# EAGLE design Group_07 (EAGLE 9.6.2)
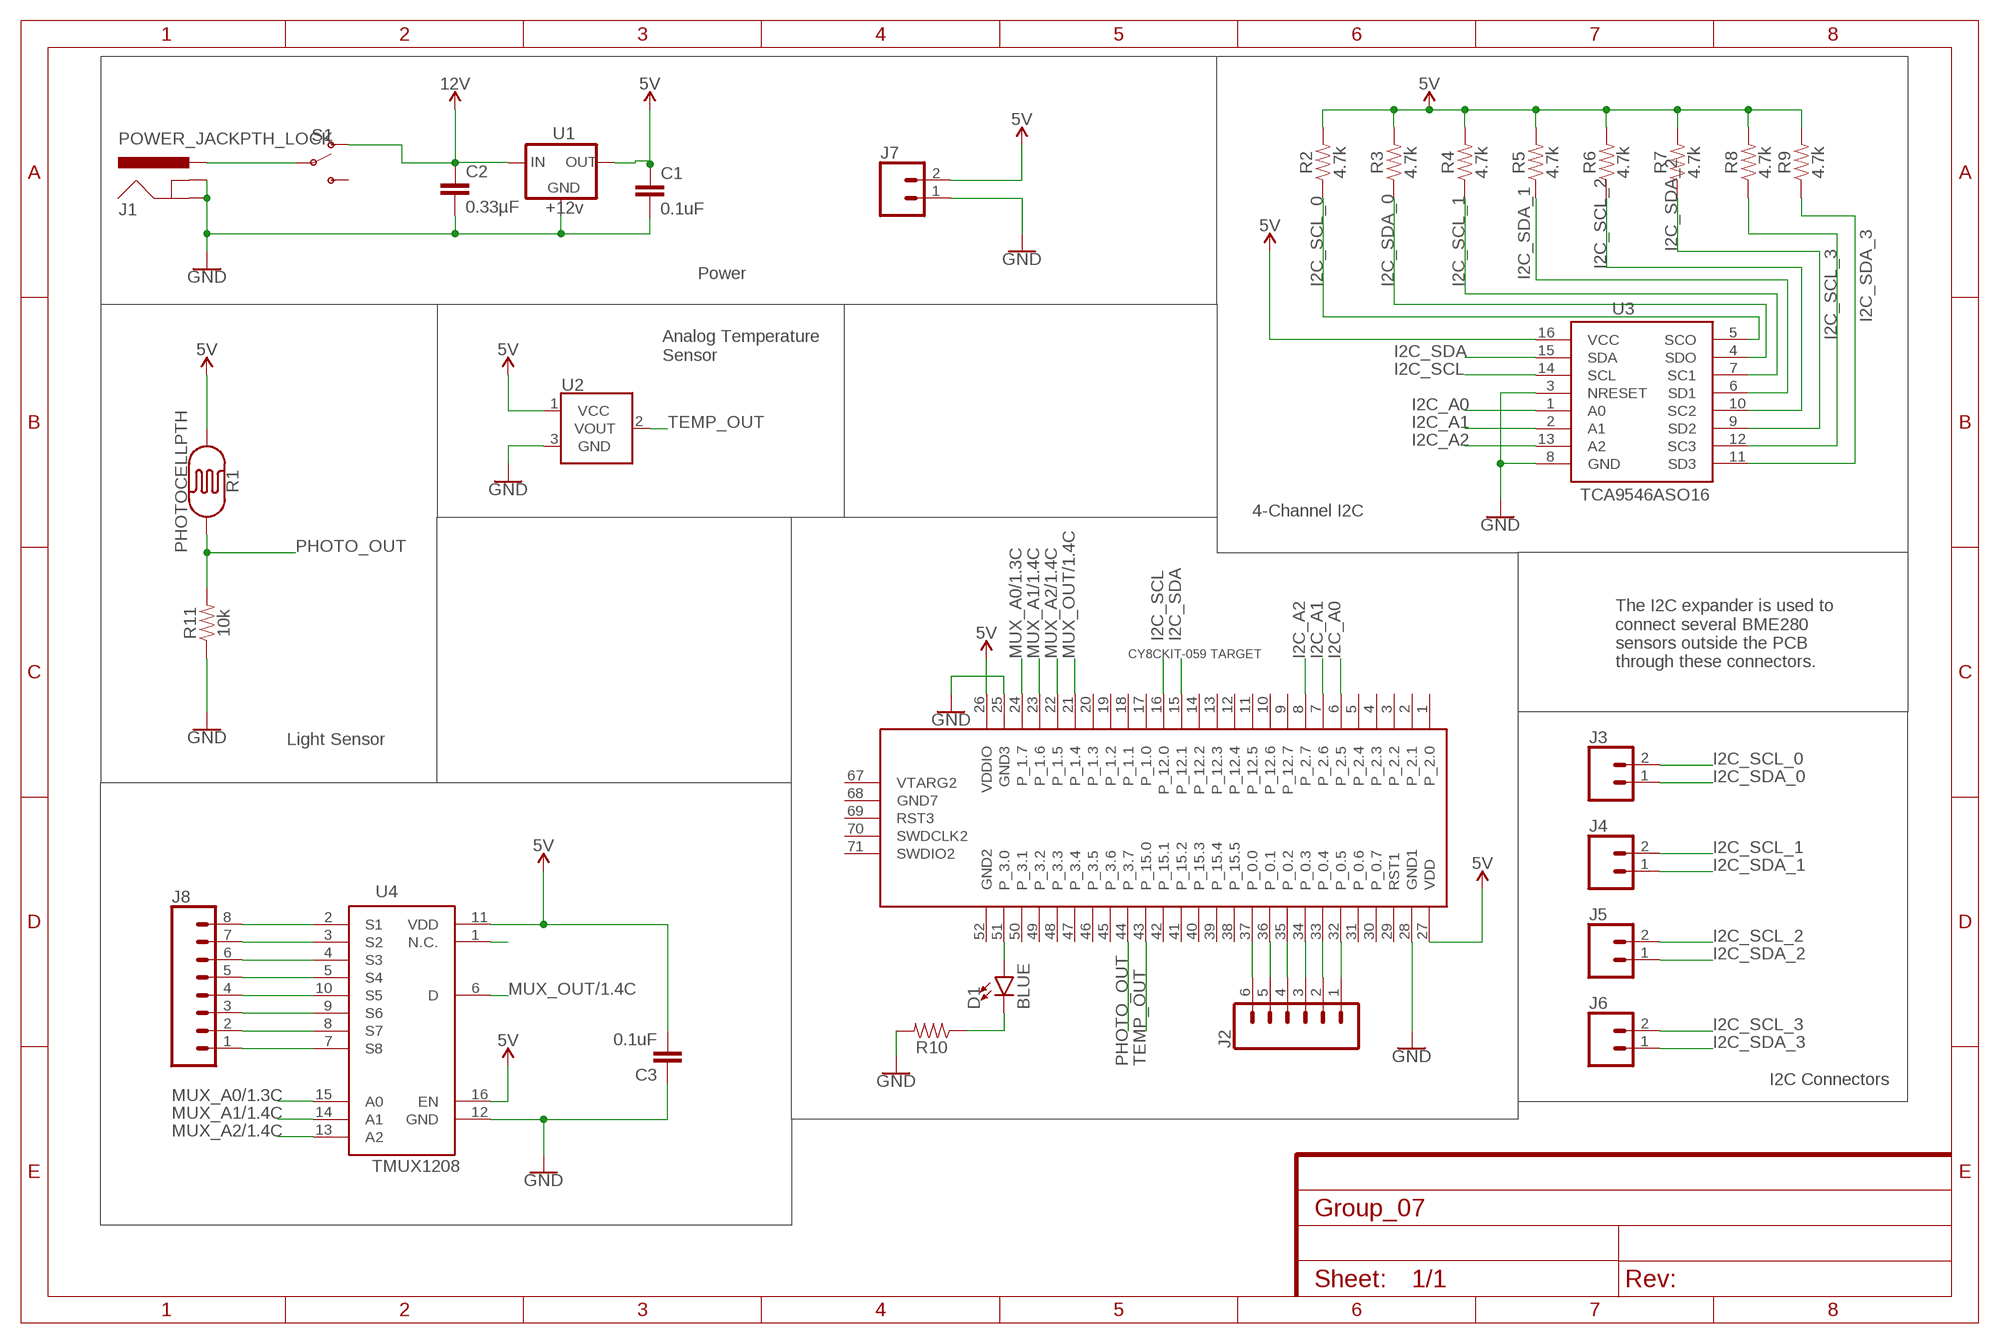
[diagram p0: schematic, sheet 1]

## Parts
C1  0.1uF  0.1UF-KIT-EZ-50V-20%  [CAP-PTH-SMALL-KIT]
C2  0.33µF  0.33UF/330NF-0805-50V-10%  [0805]
C3  0.1uF  0.1UF-KIT-EZ-50V-20%  [CAP-PTH-SMALL-KIT]
D1  BLUE  LED-BLUE1206  [LED-1206]
J1  POWER_JACKPTH_LOCK  [POWER_JACK_PTH_LOCK]
J2  CONN_06LOCK  [1X06_LOCK]
J3  CONN_02  [1X02]
J4  CONN_02  [1X02]
J5  CONN_02  [1X02]
J6  CONN_02  [1X02]
J7  CONN_02  [1X02]
J8  CONN_08LOCK  [1X08_LOCK]
R1  PHOTOCELLPTH  [PHOTOCELL]
R2  4.7k  4.7KOHM-0603-1/10W-1%  [0603]
R3  4.7k  4.7KOHM-0603-1/10W-1%  [0603]
R4  4.7k  4.7KOHM-0603-1/10W-1%  [0603]
R5  4.7k  4.7KOHM-0603-1/10W-1%  [0603]
R6  4.7k  4.7KOHM-0603-1/10W-1%  [0603]
R7  4.7k  4.7KOHM-0603-1/10W-1%  [0603]
R8  4.7k  4.7KOHM-0603-1/10W-1%  [0603]
R9  4.7k  4.7KOHM-0603-1/10W-1%  [0603]
R10  RESISTORAXIAL-0.3  [AXIAL-0.3]
R11  10k  10KOHM-0603-1/10W-1%  [0603]
S1  SWITCH-SPDT-PTH-11.6X4.0MM  [SWITCH_SPDT_PTH_11.6X4.0MM]
U1  +12v  V_REG_78XX7812  [TO-252]
U2  TMP36GT9  [TO-92]
U3  TCA9546ASO16  [TSSOP16]
U4  TMUX1208  [QFN16]
U$1  CY8CKIT-059_TARGET  [CY8CKIT-059_TARGET]

## Nets
5V: C1.1 C3.2 J7.2 R1.1 R2.2 R3.2 R4.2 R5.2 R6.2 R7.2 R8.2 R9.2 U1.2(OUT) U2.1(VCC) U3.16(VCC) U4.11(VDD) U$1.27(VDD)
12V: C2.1 S1.1(O) U1.1(IN)
GND: C1.2 C2.2 C3.1 J1.GND J1.GNDBREAK J7.1 R10.P$2 R11.1 U1.3(GND) U2.3(GND) U3.3(NRESET) U3.8(GND) U4.12(GND) U$1.25(GND3)
I2C_A0: U3.1(A0) U$1.6(P_2.5)
I2C_A1: U3.2(A1) U$1.7(P_2.6)
I2C_A2: U3.13(A2) U$1.8(P_2.7)
I2C_SCL: U3.14(SCL) U$1.16(P_12.0)
I2C_SCL_0: J3.2 R2.1 U3.5(SCO)
I2C_SCL_1: J4.2 R4.1 U3.7(SC1)
I2C_SCL_2: J5.2 R6.1 U3.10(SC2)
I2C_SCL_3: J6.2 R8.1 U3.12(SC3)
I2C_SDA: U3.15(SDA) U$1.15(P_12.1)
I2C_SDA_0: J3.1 R3.1 U3.4(SDO)
I2C_SDA_1: J4.1 R5.1 U3.6(SD1)
I2C_SDA_2: J5.1 R7.1 U3.9(SD2)
I2C_SDA_3: J6.1 R9.1 U3.11(SD3)
MUX_A0/1.3C: U4.15(A0) U$1.24(P_1.7)
MUX_A1/1.4C: U4.14(A1) U$1.23(P_1.6)
MUX_A2/1.4C: U4.13(A2) U$1.22(P_1.5)
MUX_OUT/1.4C: U4.6(D) U$1.21(P_1.4)
N$1: J1.PWR S1.2(P)
N$2: J8.8 U4.2(S1)
N$3: J2.6 U$1.37(P_0.0)
N$4: J2.5 U$1.36(P_0.1)
N$5: J2.4 U$1.35(P_0.2)
N$6: J2.3 U$1.34(P_0.3)
N$7: J2.2 U$1.33(P_0.4)
N$8: J2.1 U$1.32(P_0.5)
N$9: D1.A U$1.51(P_3.0)
N$10: D1.C R10.P$1
N$11: J8.7 U4.3(S2)
N$12: J8.6 U4.4(S3)
N$13: J8.5 U4.5(S4)
N$14: J8.4 U4.10(S5)
N$15: J8.3 U4.9(S6)
N$16: J8.2 U4.8(S7)
N$17: J8.1 U4.7(S8)
N$18: U$1.26(VDDIO) ; supply symbol labelled 5V
N$19: U4.1(N.C.)
N$20: U$1.28(GND1) ; supply symbol labelled GND
N$21: U4.16(EN) ; supply symbol labelled 5V
PHOTO_OUT: R1.2 R11.2 U$1.44(P_3.7)
TEMP_OUT: U2.2(VOUT) U$1.43(P_15.0)
Unconnected: S1.3(S) U$1.1(P_2.0) U$1.2(P_2.1) U$1.3(P_2.2) U$1.4(P_2.3) U$1.5(P_2.4) U$1.9(P_12.7) U$1.10(P_12.6) U$1.11(P_12.5) U$1.12(P_12.4) U$1.13(P_12.3) U$1.14(P_12.2) U$1.17(P_1.0) U$1.18(P_1.1) U$1.19(P_1.2) U$1.20(P_1.3) U$1.29(RST1) U$1.30(P_0.7) U$1.31(P_0.6) U$1.38(P_15.5) U$1.39(P_15.4) U$1.40(P_15.3) U$1.41(P_15.2) U$1.42(P_15.1) U$1.45(P_3.6) U$1.46(P_3.5) U$1.47(P_3.4) U$1.48(P_3.3) U$1.49(P_3.2) U$1.50(P_3.1) U$1.52(GND2) U$1.67(VTARG2) U$1.68(GND7) U$1.69(RST3) U$1.70(SWDCLK2) U$1.71(SWDIO2)

## Notes on the sheet
- Power
- Analog Temperature
  Sensor
- 4-Channel I2C
- The I2C expander is used to
  connect several BME280
  sensors outside the PCB
  through these connectors.
- Light Sensor
- I2C Connectors

## Library data of the parts
C1 C3 = SparkFun-Capacitors:0.1UF: 0.1µF ceramic capacitors A capacitor is a passive two-terminal electrical component used to store electrical energy temporarily in an electric field.; PROD_ID: CAP-08370
C2 = SparkFun-Capacitors:0.33UF/330NF: 0.33µF/330nF ceramic capacitors A capacitor is a passive two-terminal electrical component used to store electrical energy temporarily in an electric field.; PROD_ID: CAP-08469
D1 = SparkFun-LED:LED-BLUE: Blue SMD LED Used in manufacturing of various products at SparkFun Packages: 0603 - SMD 0603 package [Product Link] <http://www.digikey.com/product-detail/en/SMLE12BC7TT86/511-1589-2-ND/1641808> 1206 - SMD1206 package [Product Link] <http://www.digikey.com/product-detail/en/lite-on-inc/LTST-C150TBKT/160-1643-1-ND/573584> SparkFun Products: ESP8266 Thing-Dev Board <https://www.sparkfun.com/products/13711> RedBoard <https://www.sparkfun.com/products/12757>; PROD_ID: DIO-09911
J1 = SparkFun-Connectors:POWER_JACK: Power Jack Connector This is the standard 5.5mm barrel jack for power. The PTH is the most common, proven, reliable, footprint. The Slot footprint only works if the mill layer is transmitted to the PCB fab house so be warned. Here are the connectors we sell at SparkFun: DC Barrel Power Jack/Connector <https://www.sparkfun.com/products/119> (PRT-00119) DC Barrel Power Jack/Connector (SMD) <https://www.sparkfun.com/products/12748> (PRT-12748) DC Barrel Jack Adapter - Breadboard Compatible <https://www.sparkfun.com/products/10811> (PRT-10811) It is used on this SparkFun product (and many, many others): SparkFun RedBoard - Programmed with Arduino <https://www.sparkfun.com/products/12757> (DEV-12757) Also, if you need a mating power supply or connector, please check these out: Wall Adapter Power Supply - 9VDC 650mA <https://www.sparkfun.com/products/298> (TOL-00298) DC Barrel Jack Adapter - Male <https://www.sparkfun.com/products/10287> (PRT-10287); PROD_ID: CONN-08197; SF_ID: PRT-00119
J2 = SparkFun-Connectors:CONN_06: Multi connection point. Often used as Generic Header-pin footprint for 0.1 inch spaced/style header connections On any of the 0.1 inch spaced packages, you can populate with these: Break Away Headers - Straight <https://www.sparkfun.com/products/116> (PRT-00116) Break Away Male Headers - Right Angle <https://www.sparkfun.com/products/553> (PRT-00553) Female Headers <https://www.sparkfun.com/products/115> (PRT-00115) Break Away Headers - Machine Pin <https://www.sparkfun.com/products/117> (PRT-00117) Break Away Female Headers - Swiss Machine Pin <https://www.sparkfun.com/products/743> (PRT-00743) Arduino Stackable Header - 6 Pin <https://www.sparkfun.com/products/9280> (PRT-09280) For SCREWTERMINALS and SPRING TERMINALS visit here: Screw Terimnals on SparkFun.com <https://www.sparkfun.com/search/results?term=Screw+Terminals> (5mm/3.5mm/2.54mm spacing) This device is also useful as a general connection point to wire up your design to another part of your project. Our various solder wires solder well into these plated through hole pads. Hook-Up Wire - Assortment (Stranded, 22 AWG) <https://www.sparkfun.com/products/11375> (PRT-11375) Hook-Up Wire - Assortment (Solid Core, 22 AWG) <https://www.sparkfun.com/products/11367> (PRT-11367) View the entire wire category on our website here <https://www.sparkfun.com/categories/141>
J3-J7 = SparkFun-Connectors:CONN_02: Multi connection point. Often used as Generic Header-pin footprint for 0.1 inch spaced/style header connections On any of the 0.1 inch spaced packages, you can populate with these: Break Away Headers - Straight <https://www.sparkfun.com/products/116> (PRT-00116) Break Away Male Headers - Right Angle <https://www.sparkfun.com/products/553> (PRT-00553) Female Headers <https://www.sparkfun.com/products/115> (PRT-00115) Break Away Headers - Machine Pin <https://www.sparkfun.com/products/117> (PRT-00117) Break Away Female Headers - Swiss Machine Pin <https://www.sparkfun.com/products/743> (PRT-00743) For SCREWTERMINALS and SPRING TERMINALS visit here: Screw Terimnals on SparkFun.com <https://www.sparkfun.com/search/results?term=Screw+Terminals> (5mm/3.5mm/2.54mm spacing) This device is also useful as a general connection point to wire up your design to another part of your project. Our various solder wires solder well into these plated through hole pads. Hook-Up Wire - Assortment (Stranded, 22 AWG) <https://www.sparkfun.com/products/11375> (PRT-11375) Hook-Up Wire - Assortment (Solid Core, 22 AWG) <https://www.sparkfun.com/products/11367> (PRT-11367) View the entire wire category on our website here <https://www.sparkfun.com/categories/141> Special notes: Molex polarized connector foot print use with: PRT-08233 with associated crimp pins and housings. 2.54_SCREWTERM for use with PRT-10571. 3.5mm Screw Terminal footprints for PRT-08084 5mm Screw Terminal footprints for use with PRT-08432
J8 = SparkFun-Connectors:CONN_08: Multi connection point. Often used as Generic Header-pin footprint for 0.1 inch spaced/style header connections On any of the 0.1 inch spaced packages, you can populate with these: Break Away Headers - Straight <https://www.sparkfun.com/products/116> (PRT-00116) Break Away Male Headers - Right Angle <https://www.sparkfun.com/products/553> (PRT-00553) Female Headers <https://www.sparkfun.com/products/115> (PRT-00115) Break Away Headers - Machine Pin <https://www.sparkfun.com/products/117> (PRT-00117) Break Away Female Headers - Swiss Machine Pin <https://www.sparkfun.com/products/743> (PRT-00743) Arduino Stackable Header - 8 Pin <https://www.sparkfun.com/products/9279> (PRT-09279) For SCREWTERMINALS and SPRING TERMINALS visit here: Screw Terimnals on SparkFun.com <https://www.sparkfun.com/search/results?term=Screw+Terminals> (5mm/3.5mm/2.54mm spacing) This device is also useful as a general connection point to wire up your design to another part of your project. Our various solder wires solder well into these plated through hole pads. Hook-Up Wire - Assortment (Stranded, 22 AWG) <https://www.sparkfun.com/products/11375> (PRT-11375) Hook-Up Wire - Assortment (Solid Core, 22 AWG) <https://www.sparkfun.com/products/11367> (PRT-11367) View the entire wire category on our website here <https://www.sparkfun.com/categories/141> Special notes: Molex polarized connector foot print use with SKU : PRT-08231 with associated crimp pins and housings. 1MM SMD Version SKU: PRT-10208 NOTES ON THE VARIANTS LOCK and LOCK_LONGPADS... This footprint was designed to help hold the alignment of a through-hole component (i.e. 6-pin header) while soldering it into place. You may notice that each hole has been shifted either up or down by 0.005 of an inch from it's more standard position (which is a perfectly straight line). This slight alteration caused the pins (the squares in the middle) to touch the edges of the holes. Because they are alternating, it causes a "brace" to hold the component in place. 0.005 has proven to be the perfect amount of "off-center" position when using our standard breakaway headers. Although looks a little odd when you look at the bare footprint, once you have a header in there, the alteration is very hard to notice. Also,if you push a header all the way into place, it is covered up entirely on the bottom side.
R1 = SparkFun-Sensors:PHOTOCELL: Photocell (Photodetector, Photo Resistor, CdS) This is a very small light sensor. A photocell changes (also called a photodetector, photo resistor, CdS or photoconductive cell) resistance depending on the amount of light it is exposed to. These little sensors make great ambient light triggers (when light in the room turns on, do something). Datasheet <http://cdn.sparkfun.com/datasheets/Sensors/LightImaging/SEN-09088.pdf> SparkFun Products Mini Photocell <https://www.sparkfun.com/products/9088> (SEN-09088); PROD_ID: COMP-09129; SF_ID: SEN-09088
R2-R9 = SparkFun-Resistors:4.7KOHM: 4.7kΩ resistor A resistor is a passive two-terminal electrical component that implements electrical resistance as a circuit element. Resistors act to reduce current flow, and, at the same time, act to lower voltage levels within circuits. - Wikipedia; PROD_ID: RES-07857
R10 = SparkFun-Resistors:RESISTOR: Generic Resistor Package
R11 = SparkFun-Resistors:10KOHM: 10kΩ resistor A resistor is a passive two-terminal electrical component that implements electrical resistance as a circuit element. Resistors act to reduce current flow, and, at the same time, act to lower voltage levels within circuits. - Wikipedia; PROD_ID: RES-00824
S1 = SparkFun-Switches:SWITCH-SPDT: Single Pole, Double Throw (SPDT) Switch Single-pole, double-throw (SPDT) switch. Variant Overview SMD-AYZ0202 Surface Mount DPDT Switch <https://www.sparkfun.com/products/597> (COM-00597) Used on e.g. LilyPad Arduino USB - ATmega32U4 Board <https://www.sparkfun.com/products/12049> PTH-11.6X4.0MM SPDT Mini Power Switch <https://www.sparkfun.com/products/102> (COM-00102) Used on e.g. SparkFun Simon Says - Through-Hole Soldering Kit <https://www.sparkfun.com/products/10547> (KIT-10547) PTH-11.6X4.0MM-KIT KIT version of SPDT Mini Power Switch - Simplifies soldering by removing tStop of switch pins - only one side can be soldered. PTH-11.6X4.0MM-LOCK LOCK version of SPDT Mini Power Switch - Offset pins hold switch in place for easier soldering. SMD-RIGHT-ANGLE Surface Mount Right Angle Switch <https://www.sparkfun.com/products/10860> (COM-10860) Used on e.g. SparkFun ESP8266 Thing <https://www.sparkfun.com/products/13231>; PROD_ID: SWCH-08261; SF_SKU: COM-00102
U1 = SparkFun-IC-Power:V_REG_78XX: Voltage Regulator Standard 78xx regulator. IGO (Input Ground Output). Spark Fun Electronics SKU : COM-00107; PROD_ID: VREG-12370
U2 = SparkFun-Sensors:TMP36: TMP36 Precision Analog °C Temperature Sensor The TMP36 is a low voltage, precision centigrade temperature sensor. It provides a voltage output that is linearly proportional to the Celsius temperature. It also doesn’t require any external calibration to provide typical accuracies of ±1°C at +25°C and ±2°C over the −40°C to +125°C temperature range. We like it because it’s so easy to use: Just give the device a ground and 2.7 to 5.5 VDC and read the voltage on the Vout pin. The output voltage can be converted to temperature easily using the scale factor of 10 mV/°C. Datasheet <http://cdn.sparkfun.com/datasheets/Sensors/Temp/TMP35_36_37.pdf> SparkFun Products Temperature Sensor - TMP36 <https://www.sparkfun.com/products/10988> (SEN-10988) SparkFun Danger Shield <https://www.sparkfun.com/products/11649> (DEV-11649); PROD_ID: IC-09880; SF_ID: SEN-10988
U3 = Group_07_Library:TCA9546A: TCA9546A The TCA9546A is a quad 2 bidirectional translating switch controlled via the I C bus. The SCL/SDA upstream pair fans out to four downstream pairs, or channels. Any individual SCn/SDn channel or combination of channels can be selected, determined by the contents of the programmable control register. An active-low reset (RESET) input allows the TCA9546A to recover from a situation in which one of the downstream I2C buses is stuck in a low state. Pulling RESET low resets the I2C state machine and causes all the channels to be deselected, as does the internal power-on reset function. The pass gates of the switches are constructed such that the VCC pin can be used to limit the maximum high voltage, which will be passed by the TCA9546A. This allows the use of different bus voltages on each pair, so that 1.8-V, 2.5-V, or 3.3-V parts can communicate with 5-V parts without any additional protection. External pull-up resistors pull the bus up to the desired voltage level for each channel. All I/O pins are 5.5-V tolerant. Available packages: TSSOP16
U4 = Group_07_Library:TMUX1208: TMUX1208 The TMUX1208 and TMUX1209 are general purpose complementary metal-oxide semiconductor (CMOS) multiplexers (MUX). The TMUX1208 offers 8:1 singleended channels, while the TMUX1209 offers differential 4:1 or dual 4:1 single-ended channels. Wide operating supply of 1.08 V to 5.5 V allows for use in a broad array of applications from personal electronics to building automation applications. The device supports bidirectional analog and digital signals on the source (Sx) and drain (D) pins ranging from GND to VDD. All logic inputs have 1.8 V logic compatible thresholds, ensuring both TTL and CMOS logic compatibility when operating in the valid supply voltage range. Fail-Safe Logic circuitry allows voltages on the control pins to be applied before the supply pin, protecting the device from potential damage. Available packages: QFN16
U$1 = CYKIT:CY8CKIT-059_TARGET

## Board
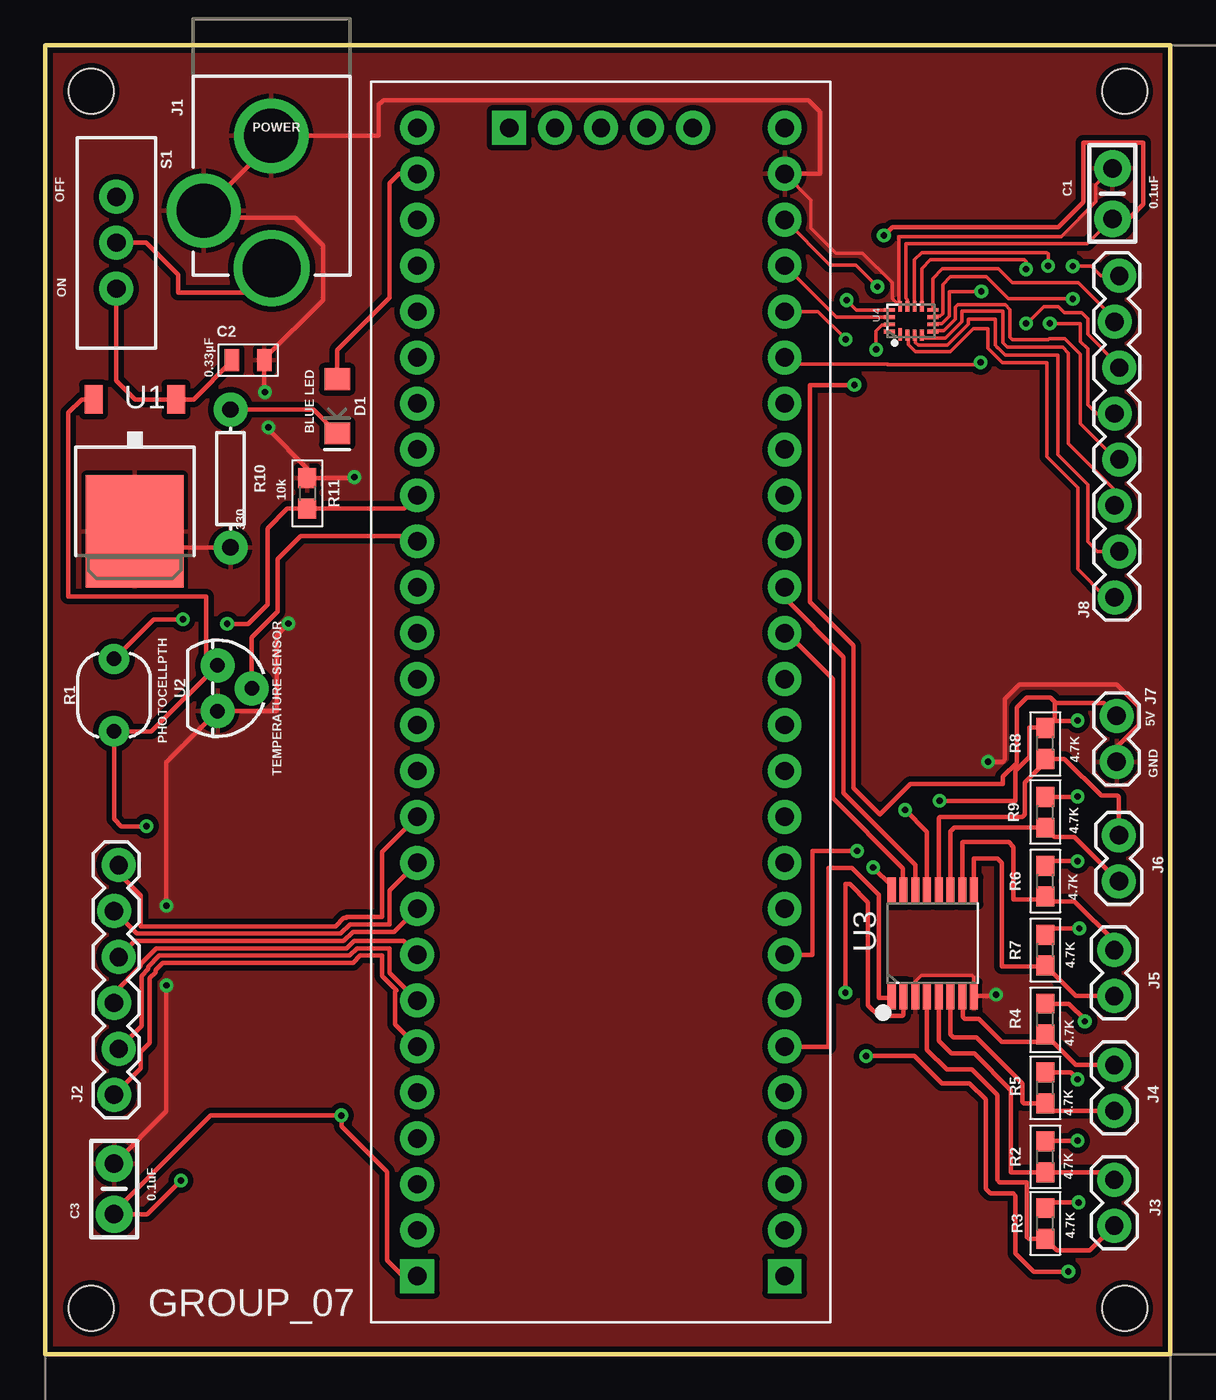
[diagram p1: board, top side]
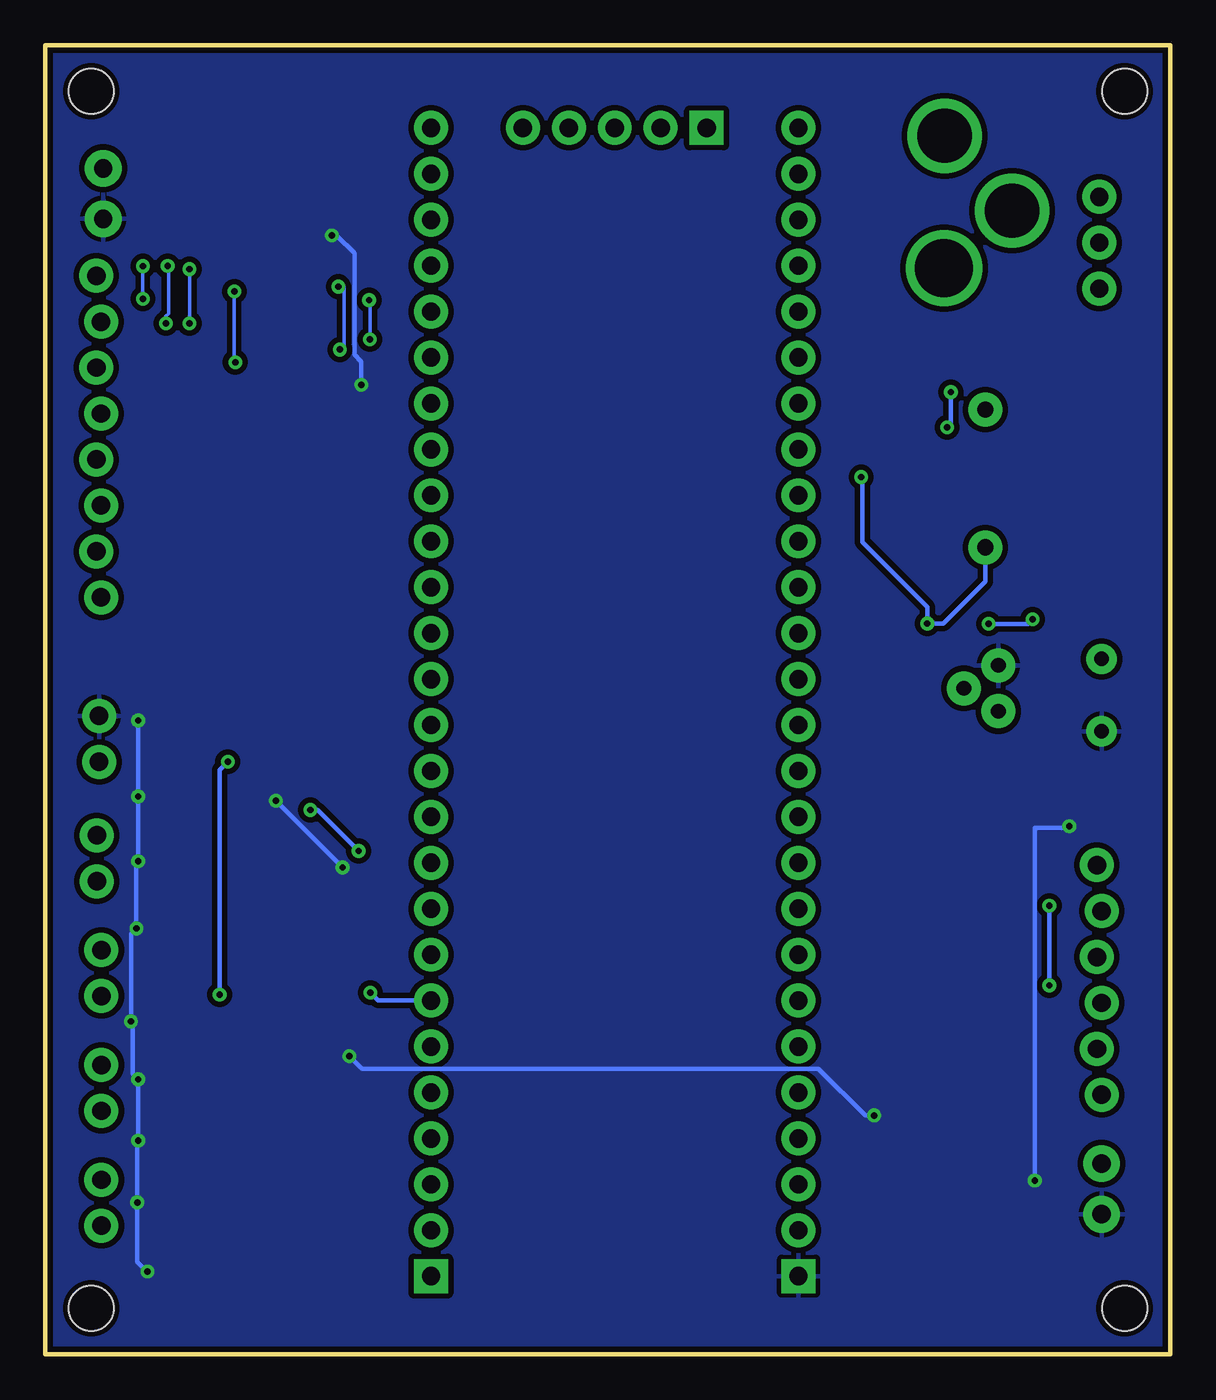
[diagram p2: board, bottom side, seen from below]

Size 62.23 x 72.39 mm. Coordinates in mm from the lower left corner, seen from the top.
Outline: 0,0 0,72.39 62.23,72.39 62.23,0 0,0
Copper layers (1*16): Top 0.035mm / dielectric 1.48mm / Bottom 0.035mm
Design rules "Group_07": minimum track width 6mil, minimum drill 8mil, track to track 6mil, track to pad 6mil, pad to pad 6mil, via to via 6mil, smd to smd 6mil, copper to edge 6mil, drill to drill 22mil, minimum pad ring 10mil, minimum via ring 8mil, stop-mask expansion 8mil, vias tented up to drill 0mil, thermal gap 10mil
Holes 2.5 mm at 2.54,2.54 59.69,2.54 2.54,69.85 59.69,69.85

### Footprints (pad centres in the part's own frame; a part is rotated, then mirrored left to right if it is on the bottom)
CAP-PTH-SMALL-KIT = drill 1.016 pad 2.032: 1 -1.397,0; 2 1.397,0
0805 = smd 0.8 x 1.2: 1 -0.9,0; 2 0.9,0
LED-1206 = smd 1.2 x 1.4: A -1.5,0; C 1.5,0
POWER_JACK_PTH_LOCK = drill 2.997 pad 4.115: GND 0.025,6.557; GNDBREAK 3.762,10.7 | drill 3.2 pad 4.115: PWR 0,13.878
1X06_LOCK = drill 1.016 pad 1.88: 1 0,0; 2 2.54,-0.254; 3 5.08,0; 4 7.62,-0.254; 5 10.16,0; 6 12.7,-0.254
1X02 = drill 1.016 pad 1.88: 1 0,0; 2 2.54,0
1X08_LOCK = drill 1.016 pad 1.88: 1 0,0.127; 2 2.54,-0.127; 3 5.08,0.127; 4 7.62,-0.127; 5 10.16,0.127; 6 12.7,-0.127; 7 15.24,0.127; 8 17.78,-0.127
PHOTOCELL = drill 0.8 pad 1.676: 1 -2,0; 2 2,0
0603 = smd 1.1 x 1: 1 -0.85,0; 2 0.85,0
AXIAL-0.3 = drill 0.9 pad 1.88: P$1 -3.81,0; P$2 3.81,0
SWITCH_SPDT_PTH_11.6X4.0MM = drill 1.016 pad 1.88: 1 0,2.54; 2 0,0; 3 0,-2.54
TO-252 = smd 1 x 1.6: 1 -2.28,-4.8; 2 2.28,-4.8 | smd 5.4 x 6.2: 3 0,2.5
TO-92 = drill 0.813 pad 1.88: 1 -1.27,0; 2 0,1.905; 3 1.27,0
TSSOP16 = smd 1.5 x 0.45: 1 -2.9,2.275; 2 -2.9,1.625; 3 -2.9,0.975; 4 -2.9,0.325; 5 -2.9,-0.325; 6 -2.9,-0.975; 7 -2.9,-1.625; 8 -2.9,-2.275; 9 2.9,-2.275; 10 2.9,-1.625; 11 2.9,-0.975; 12 2.9,-0.325; 13 2.9,0.325; 14 2.9,0.975; 15 2.9,1.625; 16 2.9,2.275
QFN16 = smd 0.7 x 0.2: 1 -0.75,0.6 | smd 0.6 x 0.2: 2 -0.8,0.2; 3 -0.8,-0.2; 4 -0.8,-0.6; 9 0.8,-0.6; 10 0.8,-0.2; 11 0.8,0.2; 12 0.8,0.6 | smd 0.2 x 0.6: 5 -0.6,-1.2; 6 -0.2,-1.2; 7 0.2,-1.2; 8 0.6,-1.2; 13 0.6,1.2; 14 0.2,1.2; 15 -0.2,1.2; 16 -0.6,1.2
CY8CKIT-059_TARGET = drill 1.016 pad 1.876 square: 1 30.48,8.89; 27 30.48,-11.43; 71 -33.02,-6.35 | drill 1.016 pad 1.876: 2 27.94,8.89; 3 25.4,8.89; 4 22.86,8.89; 5 20.32,8.89; 6 17.78,8.89; 7 15.24,8.89; 8 12.7,8.89; 9 10.16,8.89; 10 7.62,8.89; 11 5.08,8.89; 12 2.54,8.89; 13 0,8.89; 14 -2.54,8.89; 15 -5.08,8.89; 16 -7.62,8.89; 17 -10.16,8.89; 18 -12.7,8.89; 19 -15.24,8.89; 20 -17.78,8.89; 21 -20.32,8.89; 22 -22.86,8.89; 23 -25.4,8.89; 24 -27.94,8.89; 25 -30.48,8.89; 26 -33.02,8.89; 28 27.94,-11.43; 29 25.4,-11.43; 30 22.86,-11.43; 31 20.32,-11.43; 32 17.78,-11.43; 33 15.24,-11.43; 34 12.7,-11.43; 35 10.16,-11.43; 36 7.62,-11.43; 37 5.08,-11.43; 38 2.54,-11.43; 39 0,-11.43; 40 -2.54,-11.43; 41 -5.08,-11.43; 42 -7.62,-11.43; 43 -10.16,-11.43; 44 -12.7,-11.43; 45 -15.24,-11.43; 46 -17.78,-11.43; 47 -20.32,-11.43; 48 -22.86,-11.43; 49 -25.4,-11.43; 50 -27.94,-11.43; 51 -30.48,-11.43; 52 -33.02,-11.43; 67 -33.02,3.81; 68 -33.02,1.27; 69 -33.02,-1.27; 70 -33.02,-3.81

### Placement (x,y rotation side)
C1  59.02,64.19 90 top
C2  11.22,54.98 0 top
C3  3.81,9.14 270 top
D1  16.15,52.42 270 top
J1  12.52,73.94 180 top
J2  3.81,14.35 90 top
J3  59.12,7.11 90 top
J4  59.12,13.46 90 top
J5  59.12,19.81 90 top
J6  59.37,26.16 90 top
J7  59.25,32.76 90 top
J8  59.27,59.64 270 top
R1  3.81,36.45 90 top
R2  55.31,10.92 90 top
R3  55.31,7.24 90 top
R4  55.31,18.54 90 top
R5  55.31,14.73 90 top
R6  55.31,26.16 90 top
R7  55.31,22.35 90 top
R8  55.31,33.78 90 top
R9  55.31,29.97 90 top
R10  10.24,48.43 270 top
R11  14.49,47.61 270 top
S1  3.94,61.47 180 top
U1  4.95,48.01 180 top
U2  9.53,36.83 270 top
U3  49.09,22.73 90 top
U4  47.88,57.15 90 top
U$1  32,34.8 270 top

### Tracks (layer width: path | path; a pad name or v marks a point on that pad's centre or on a via)
5V  (via drill 0.35)
  Top 0.152: 3.68,7.62 C3.2
  Top 0.203: U4.11 47.68,58.33 47.6,58.41 47.6,61.41 57.64,61.41 C1.1 59.92,62.79
  Top 0.254: 55.88,36 58.55,36 J7.2 | U3.16 46.81,25.89 v45.78,26.92 | v49.47,30.61 53.66,30.61 53.66,32.26 54.42,33.02 54.42,34.67 55.27,34.67 R8.2 | v57.09,35.05 57.07,35.03 55.71,35.03 R8.2 | v57.09,30.84 57.06,30.82 R9.2 | v57.09,27.27 55.57,27.27 R6.2 | R7.2 55.66,23.55 v57.19,23.55 | v57.49,18.41 57.49,18.52 56.62,19.39 R4.2 | v57.09,15.2 56.71,15.58 R5.2 | v57.09,11.81 55.35,11.81 R2.2 | v57.14,8.4 55.62,8.4 R3.2 | 3.68,7.62 3.56,7.62 9.14,13.21 v16.38,13.21 16.38,12.62 18.9,10.1 18.9,5.2 19.78,4.32 U$1.27 | v46.38,61.86 46.84,62.32 56.02,62.32 57.42,63.72 57.42,67.01 60.72,67.01 60.72,63.59 59.92,62.79 | v56.58,4.57 54.67,4.57 53.66,5.59 53.66,8.76 53.53,8.89 52.26,8.89 52.01,9.14 52.01,14.1 51.12,14.98 49.59,14.98 48.07,16.51 45.4,16.51 v45.4,16.48 | U1.2 2.01,52.81 1.27,52.07 1.27,41.91 8.89,41.91 8.89,38.73 U2.1 5.87,34.45 R1.1 3.81,29.59 4.2,29.2 v5.6,29.2 v5.6,29.21 | R8.2 55.84,35.16 55.84,35.97 55.88,36 | v7.5,9.6 5.65,7.75 C3.2 | 55.88,36 55.57,36.31 54.27,36.31 53.72,35.76 53.72,32.71 52.96,31.95 52.96,31.53 47.84,31.53 46.16,29.85 44.7,31.32 44.7,39.2 42.3,41.6 42.3,53.6 v44.75,53.6
  Bottom 0.254: v49.47,30.61 v45.78,26.92 | v57.09,35.05 v57.09,30.84 v57.09,27.27 57.19,27.17 v57.19,23.55 57.49,23.25 v57.49,18.41 57.39,18.31 57.39,15.5 v57.09,15.2 v57.09,11.81 57.14,11.76 v57.14,8.4 57.14,5.13 v56.58,4.57 | v44.75,53.6 44.75,54.9 45.13,55.27 45.13,60.88 46.12,61.86 v46.38,61.86 | v16.38,13.21 16.88,13.21 19.46,15.79 44.7,15.79 v45.4,16.48 | v5.6,29.21 5.71,29.1 7.5,29.1 v7.5,9.6
  pour Bottom (isolate 0.305): 0,0 0,72.43 62.23,72.43 62.23,0
12V
  Top 0.254: S1.1 3.94,53.85 4.98,52.81 U1.1 8.2,52.81 10.32,54.92 C2.1
GND  (via drill 0.35)
  Top 0.203: C1.2 58.1,64.66 58.1,63.74 56.18,61.82 47.2,61.82 47.2,58.03 U4.12 46.85,58.38 46.85,59.25 45.2,60.9 43.72,60.9 42.35,62.27 42.35,63.83 U$1.25 | U3.3 48.11,20.61 48.45,20.95 51.25,20.95 51.36,20.84 U3.8
  Top 0.254: U$1.25 42.85,65.28 42.85,68.7 42.2,69.35 18.7,69.35 18.45,69.1 18.45,67.38 J1.GND 12.52,67.37 12.52,67 J1.GNDBREAK 9.15,62.85 13.81,62.85 15.36,61.3 15.36,58.3 12.12,55.06 C2.2 12.12,53.24 v12.15,53.21 | U3.8 52.53,19.83 v52.59,19.89 | v52.13,32.76 52.96,32.76 53.08,32.89 53.08,36.23 53.87,37.03 59.25,37.03 60.47,35.81 60.47,34.8 59.25,33.58 J7.1 | C3.1 6.7,13.43 v6.7,20.4 | v6.7,24.8 6.7,32.73 U2.3 12.8,35.56 12.8,39.76 v13.45,40.41 | R10.P$2 4.5,44.61 3.5,45.61 4.85,45.61 U1.3 | v17.1,48.51 17.05,48.46 R11.1 14.49,48.99 12.35,51.13 v12.35,51.26
  Bottom 0.254: v52.13,32.76 52.59,32.31 v52.59,19.89 | v6.7,20.4 v6.7,24.8 | R10.P$2 10.24,42.72 12.55,40.41 v13.45,40.41 13.45,41.31 17.05,44.91 17.05,48.51 v17.1,48.51 | v12.15,53.21 12.15,51.46 v12.35,51.26
  pour Top (isolate 0.305): 0,0 0,72.39 62.23,72.39 62.23,0
I2C_A0
  Top 0.254: U3.1 46.68,19.7 46.1,19.7 46.1,25.4 44.6,26.9 43.3,26.9 43.3,17 40.91,17 U$1.6
I2C_A1  (via drill 0.35)
  Top 0.254: U3.2 47.46,18.76 47.4,18.7 46.1,18.7 45.5,19.3 45.5,25 44.5,26 44.25,26 v44.25,20
  Bottom 0.254: v44.25,20 43.81,19.56 U$1.7
I2C_A2  (via drill 0.35)
  Top 0.254: U3.13 48.76,28.9 v47.56,30.1 | U$1.8 42.43,22.1 42.43,27.83 v44.9,27.83
  Bottom 0.254: v47.56,30.1 47.16,30.1 v44.9,27.83
I2C_SCL
  Top 0.254: U3.14 48.11,27.06 44.13,31.04 44.13,38.57 40.89,41.81 U$1.16
I2C_SCL_0
  Top 0.254: U3.5 49.41,17.33 50.1,16.64 51.37,16.64 53.41,14.6 53.41,10.07 R2.1 58.7,10.07 J3.2
I2C_SCL_1
  Top 0.254: U3.7 50.74,19.8 50.74,18.67 50.87,18.54 51.63,18.54 52.9,17.27 54.89,17.27 R4.1 57,16 J4.2
I2C_SCL_2
  Top 0.254: J5.2 59.12,22.86 56.92,25.06 55.56,25.06 R6.1 55.14,25.14 53.53,25.14 53.53,28.07 53.28,28.32 50.74,28.32 50.71,28.29 U3.10
I2C_SCL_3
  Top 0.254: U3.12 49.41,29.66 49.47,29.72 54.04,29.72 54.17,29.84 54.17,31.62 55.31,32.76 R8.1 56.37,32.93 58.4,30.9 59.3,30.9 59.37,30.83 J6.2
I2C_SDA
  Top 0.254: U3.15 47.44,25.65 47.44,26.88 43.55,30.77 43.55,37.35 41.02,39.88 U$1.15
I2C_SDA_0
  Top 0.254: U3.4 48.76,16.83 49.85,15.75 51.25,15.75 52.64,14.35 52.64,9.65 52.77,9.52 54.29,9.52 54.29,6.47 54.38,6.39 R3.1 55.95,5.75 57.76,5.75 J3.1
I2C_SDA_1
  Top 0.254: U3.6 50.06,17.69 50.23,17.52 51.5,17.52 54.04,14.98 54.04,13.97 54.13,13.88 R5.1 55.73,13.46 J4.1
I2C_SDA_2
  Top 0.254: J5.1 57,19.81 R7.1 55.27,21.46 52.9,21.46 52.9,27.18 52.64,27.43 51.37,27.43 51.36,27.42 U3.9
I2C_SDA_3
  Top 0.254: J6.1 56.92,28.61 55.82,28.61 R9.1 50.27,29.12 50.06,28.91 U3.11
MUX_A0/1.3C  (via drill 0.35)
  Top 0.203: U4.15 46.63,56.9 46.27,56.9 45.94,56.57 v45.94,55.56 | v46.02,59.04 44.82,60.24 43.39,60.24 U$1.24
  Bottom 0.203: v45.94,55.56 45.69,55.56 45.69,59.04 v46.02,59.04
MUX_A1/1.4C
  Top 0.203: U4.14 43.74,57.35 U$1.23
MUX_A2/1.4C  (via drill 0.35)
  Top 0.203: v44.27,56.13 42.74,57.66 U$1.22 | v44.32,58.29 44.86,57.75 U4.13
  Bottom 0.203: v44.32,58.29 44.27,58.24 v44.27,56.13
MUX_OUT/1.4C  (via drill 0.35)
  Top 0.203: U4.6 49.12,56.99 49.59,56.99 49.99,57.4 49.99,58.77 v51.77,58.77 | v51.72,54.86 51.59,54.73 46.57,54.73 46.6,54.76 41.25,54.76 U$1.21
  Bottom 0.203: v51.77,58.77 51.77,54.91 v51.72,54.86
N$1
  Top 0.254: S1.2 5.59,61.47 6.23,60.83 6.47,60.58 7.35,59.71 7.35,58.7 11.16,58.7 J1.PWR
N$2
  Top 0.203: U4.2 47.72,56.31 47.72,55.84 48.13,55.44 50.04,55.44 51.32,56.72 52.14,56.72 52.14,55.65 52.94,54.85 55.38,54.85 55.38,49.65 57.09,47.94 57.09,43.41 58.64,41.86 J8.8
N$3
  Top 0.254: U$1.37 18.64,27.79 18.64,24.18 16.68,24.18 16.63,24.13 16.51,24.13 16.05,23.67 5.28,23.67 5.28,25.37 4.06,26.58 J2.6
N$4
  Top 0.254: U$1.36 19.05,25.65 19.05,23.77 16.85,23.77 16.34,23.27 5.05,23.27 J2.5
N$5
  Top 0.254: U$1.35 19.3,23.37 17.02,23.37 16.51,22.86 4.95,22.86 J2.4
N$6
  Top 0.254: U$1.34 19.81,22.86 17.09,22.86 16.68,22.45 6.15,22.45 5.28,21.59 5.28,21.47 3.81,19.99 J2.3
N$7
  Top 0.254: U$1.33 19.05,21.08 19.05,22.45 17.25,22.45 16.85,22.05 6.32,22.05 5.69,21.42 5.69,21.3 5.33,20.94 5.33,18.16 J2.2
N$8
  Top 0.254: U$1.32 19.36,18.23 19.36,20.06 19.43,20.13 18.64,20.91 18.64,22.05 17.42,22.05 17.02,21.64 6.48,21.64 6.1,21.25 6.1,21.13 5.79,20.82 5.79,17.22 5.28,16.71 5.28,15.82 J2.1
N$9
  Top 0.254: D1.A 16.15,55.52 19.05,58.42 19.05,64.77 19.56,65.28 U$1.51
N$10
  Top 0.254: D1.C 14.83,52.24 R10.P$1
N$11
  Top 0.203: U4.3 48.12,56.31 48.12,55.95 48.27,55.8 49.9,55.8 51.05,56.96 51.05,57.25 52.55,57.25 52.55,55.79 52.66,55.68 52.68,55.68 53.11,55.25 55.99,55.25 55.99,49.75 57.65,48.09 57.65,44.95 58.2,44.4 J8.7
N$12
  Top 0.203: U4.4 48.52,56.35 48.67,56.19 49.79,56.19 50.7,57.1 50.7,57.68 52.95,57.68 52.95,55.94 53.21,55.68 56.26,55.68 56.59,55.35 56.59,50.35 59.14,47.8 J8.6
N$13
  Top 0.203: U4.5 49.12,56.59 49.69,56.59 50.34,57.25 50.34,57.91 50.47,58.04 53.1,58.04 53.36,57.78 53.36,56.24 53.48,56.12 55.48,56.12 55.53,56.16 56.38,56.16 57.25,55.3 57.25,51.48 59.24,49.48 J8.5
N$14  (via drill 0.35)
  Top 0.203: U4.10 48.08,60.52 48.48,60.93 55.38,60.93 55.46,60.85 v55.46,60.18 | v55.56,57 57.24,57 57.24,56.01 57.65,55.6 57.65,52.51 58.14,52.02 J8.4
  Bottom 0.203: v55.46,60.18 55.41,60.13 55.41,57.55 55.56,57.4 v55.56,57
N$15  (via drill 0.35)
  Top 0.203: U4.9 48.48,60.04 48.96,60.52 54.15,60.52 54.25,60.42 v54.25,60.01 | J8.3 59.4,54.66 57.65,56.41 57.65,57.28 57.32,57.6 56.35,57.6 56.02,57.94 55.23,57.94 54.3,57.01 v54.25,57.01
  Bottom 0.203: v54.25,60.01 v54.25,57.01
N$16
  Top 0.203: U4.8 49.08,59.49 49.63,60.04 52.7,60.04 53.48,59.26 57.13,59.26 59.14,57.25 J8.2
N$17  (via drill 0.35)
  Top 0.203: U4.7 49.12,57.39 49.48,57.39 49.63,57.55 49.63,59.16 50.06,59.58 52.05,59.58 53.26,58.37 v56.83,58.37 | J8.1 58.38,59.64 57.84,60.17 v56.83,60.17
  Bottom 0.203: v56.83,60.17 v56.83,58.37
PHOTO_OUT  (via drill 0.35)
  Top 0.254: R1.2 6,40.64 v7.62,40.64 | v10.06,40.39 11.22,40.39 12.29,41.46 12.29,45.66 13.39,46.76 R11.2 19.83,46.76 U$1.44
  Bottom 0.254: v10.06,40.39 7.87,40.39 v7.62,40.64
TEMP_OUT
  Top 0.254: U2.2 11.43,39.65 12.85,41.07 12.85,43.97 14.13,45.25 20.28,45.25 U$1.43

### Text on the board
tPlace: POWER | OFF | C1 | 0.1uF | ON | 0.33µF | BLUE LED | 10k | 330 | 5V | PHOTOCELLPTH | 4.7K | TEMPERATURE SENSOR | GND | 4.7K | 4.7K | 4.7K | 4.7K | 4.7K | 4.7K | 0.1uF | C3 | 4.7K | GROUP_07